# Altium schematic sheet 编码电子锁.SchDoc
size A4; SheetNumber: 1; SheetTotal: 1
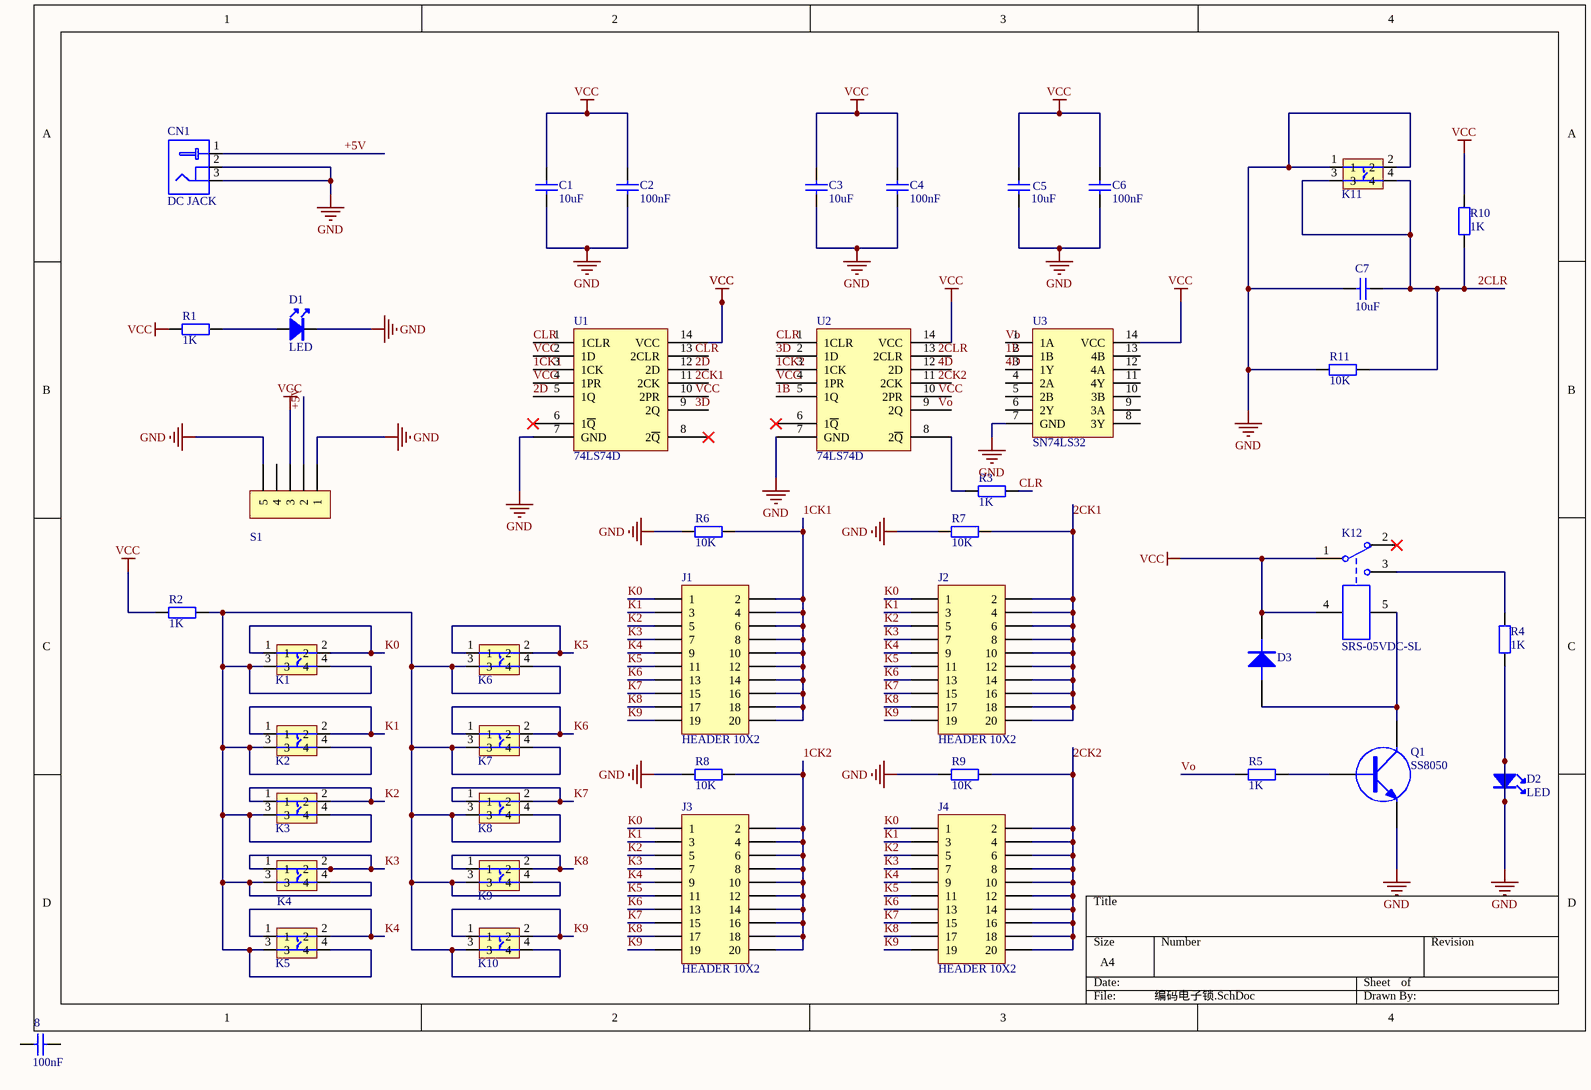
[diagram p0: 编码电子锁.SchDoc]

## Parts
8  100nF  [0805]
C1  10uF  [0805]
C2  100nF  [0805]
C3  10uF  [0805]
C4  100nF  [0805]
C5  10uF  [0805]
C6  100nF  [0805]
C7  10uF  [0805]
CN1  DC JACK  [DC JACK]
D1  LED  [3MM插件LED]
D2  LED  [3MM插件LED]
D3  1N4148  [1N5819]  (value not drawn)
J1  HEADER 10X2  [HDR2X10]
J2  HEADER 10X2  [HDR2X10]
J3  HEADER 10X2  [HDR2X10]
J4  HEADER 10X2  [HDR2X10]
K1  SW6X6轻触开关  [SW6X6轻触开关]  (value not drawn)
K2  SW6X6轻触开关  [SW6X6轻触开关]  (value not drawn)
K3  SW6X6轻触开关  [SW6X6轻触开关]  (value not drawn)
K4  SW6X6轻触开关  [SW6X6轻触开关]  (value not drawn)
K5  SW6X6轻触开关  [SW6X6轻触开关]  (value not drawn)
K6  SW6X6轻触开关  [SW6X6轻触开关]  (value not drawn)
K7  SW6X6轻触开关  [SW6X6轻触开关]  (value not drawn)
K8  SW6X6轻触开关  [SW6X6轻触开关]  (value not drawn)
K9  SW6X6轻触开关  [SW6X6轻触开关]  (value not drawn)
K10  SW6X6轻触开关  [SW6X6轻触开关]  (value not drawn)
K11  SW6X6轻触开关  [SW6X6轻触开关]  (value not drawn)
K12  SRS-05VDC-SL  [继电器]
Q1  SS8050  [S8050]
R1  1K  [0805]
R2  1K  [0805]
R3  1K  [0805]
R4  1K  [0805]
R5  1K  [0805]
R6  10K  [0805]
R7  10K  [0805]
R8  10K  [0805]
R9  10K  [0805]
R10  1K  [0805]
R11  10K  [0805]
S1  CON5  [拨动开关5脚]  (value not drawn)
U1  74LS74D  [74LS74D]
U2  74LS74D  [74LS74D]
U3  SN74LS32  [74LS32]

## Nets
GND: C1.1 C2.1 C3.1 C4.1 C5.1 C6.2 C7.1 CN1.2 CN1.3 D1.2 D2.1 D2.2 K11.1 K11.2 Q1.2(E) R4.1 R6.1 R7.1 R8.1 R9.1 R11.1 S1.1 S1.5 U1.7(GND) U2.7(GND) U3.7(GND)
VCC: C1.2 C2.2 C3.2 C4.2 C5.2 C6.1 D3.2(K) K12.1 K12.4 R1.1 R2.1 R10.2 S1.3 U1.2(1D) U1.4(1PR) U1.14(VCC) U2.4(1PR) U2.14(VCC) U3.14(VCC)
1B: U2.5(1Q) U3.2(1B)
1CK1: J1.2 J1.4 J1.6 J1.8 J1.10 J1.12 J1.14 J1.16 J1.18 J1.20 R6.2 U1.3(1CK)
1CK2: J3.2 J3.4 J3.6 J3.8 J3.10 J3.12 J3.14 J3.16 J3.18 J3.20 R8.2 U2.3(1CK)
2CK1: J2.2 J2.4 J2.6 J2.8 J2.10 J2.12 J2.14 J2.16 J2.18 J2.20 R7.2
2CK2: J4.2 J4.4 J4.6 J4.8 J4.10 J4.12 J4.14 J4.16 J4.18 J4.20 R9.2
2CLR: C7.2 K11.3 K11.4 R10.1 R11.2
2D: U1.5(1Q)
3D: U2.2(1D)
4D: U3.3(1Y)
+5V: CN1.1 S1.2
CLR: R3.2 U1.1(1CLR) U2.1(1CLR)
K0: J1.1 J2.1 J3.1 J4.1 K1.1 K1.2
K1: J1.3 J2.3 J3.3 J4.3 K2.1 K2.2
K2: J1.5 J2.5 J3.5 J4.5 K3.1 K3.2
K3: J1.7 J2.7 J3.7 J4.7 K4.1 K4.2
K4: J1.9 J2.9 J3.9 J4.9 K5.1 K5.2
K5: J1.11 J2.11 J3.11 J4.11 K6.1 K6.2
K6: J1.13 J2.13 J3.13 J4.13 K7.1 K7.2
K7: J1.15 J2.15 J3.15 J4.15 K8.1 K8.2
K8: J1.17 J2.17 J3.17 J4.17 K9.1 K9.2
K9: J1.19 J2.19 J3.19 J4.19 K10.1 K10.2
Vo: R5.1 U3.1(1A)
NetD1_1: D1.1 R1.2
NetD3_1: D3.1(A) K12.5 Q1.3(C)
NetK1_3: K1.3 K1.4 K2.3 K2.4 K3.3 K3.4 K4.3 K4.4 K5.3 K5.4 K6.3 K6.4 K7.3 K7.4 K8.3 K8.4 K9.3 K9.4 K10.3 K10.4 R2.2
NetK12_3: K12.3 R4.2
NetQ1_1: Q1.1(B) R5.2
NetR3_1: R3.1 U2.8(2~{Q})

Not connected (* = marked no-connect by the designer): 8 1 2; K12 2*; S1 4; U1 6(1~{Q})* 8(2~{Q})* 9(2Q) 10(2PR) 11(2CK) 12(2D) 13(2CLR); U2 6(1~{Q})* 9(2Q) 10(2PR) 11(2CK) 12(2D) 13(2CLR); U3 4(2A) 5(2B) 6(2Y) 8(3Y) 9(3A) 10(3B) 11(4Y) 12(4A) 13(4B)

## Notes on the sheet
- Labels drawn without touching a wire or pin: 2CK1, 2CK2, 2CLR, 2D, 3D, 4D, CLR, VCC, Vo

## Library data of the parts
8 C2 C4 C6 = 电容: 100nF，0805，+/-10%; Value: 10nF; Published: 8-Jun-2000; LatestRevisionDate: 17-Jul-2002; LatestRevisionNote: Re-released for DXP Platform.; PackageReference: RAD-0.3; Publisher: Altium Limited
C1 C3 C5 C7 = Cap: 10uF，0805，25V,+/-10%; Published: 8-Jun-2000; LatestRevisionDate: 17-Jul-2002; LatestRevisionNote: Re-released for DXP Platform.; PackageReference: RAD-0.3; Publisher: Altium Limited; Value: 10uF
CN1 = DC JACK: DC JACK电源插座,5.5mm孔径,3脚接插件
D1 D2 = 3MM插件LED: 3MM插件LED，绿发绿光，3mm
D3 = DIODE_1
K1-K11 = SW6X6轻触开关: 6*6mm*4.5mm轻触开关,4脚插件,180°
K12 = 继电器
Q1 = S8050: SOT23,3-pin,NPN型三极管，s8050
R1-R5 R10 = 电阻: 10kΩ，0805，+/-5%; Value: 10K; Published: 8-Jun-2000; LatestRevisionDate: 17-Jul-2002; LatestRevisionNote: Re-released for DXP Platform.; PackageReference: AXIAL-0.4; Publisher: Altium Limited
R6-R9 R11 = 电阻: 10kΩ，0805，+/-5%; Published: 8-Jun-2000; LatestRevisionDate: 17-Jul-2002; LatestRevisionNote: Re-released for DXP Platform.; PackageReference: AXIAL-0.4; Publisher: Altium Limited; Value: 10K
S1 = 拨动开关5脚: SWITCH